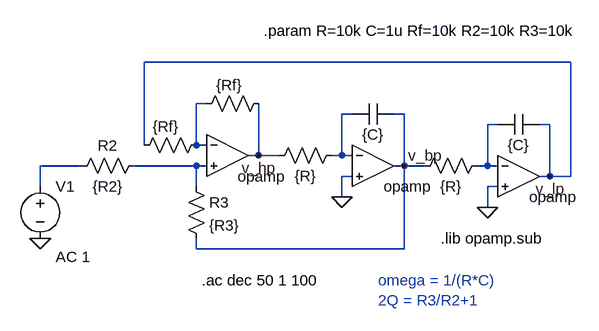
[diagram p0: schematic KHN_biquad.asc]
KHN_biquad.asc, the LTspice schematic file:
Version 4
SHEET 1 880 680
WIRE 496 0 -160 0
WIRE -64 64 -80 64
WIRE 160 80 144 80
WIRE 240 80 224 80
WIRE 384 96 368 96
WIRE 464 96 448 96
WIRE -160 128 -160 0
WIRE -80 128 -80 64
WIRE -64 128 -80 128
WIRE 16 144 16 64
WIRE 16 144 0 144
WIRE 48 144 16 144
WIRE 144 144 144 80
WIRE 144 144 128 144
WIRE 160 144 144 144
WIRE -256 160 -320 160
WIRE -80 160 -176 160
WIRE -64 160 -80 160
WIRE 240 160 240 80
WIRE 240 160 224 160
WIRE 272 160 240 160
WIRE 368 160 368 96
WIRE 368 160 352 160
WIRE 384 160 368 160
WIRE 160 176 144 176
WIRE 464 176 464 96
WIRE 464 176 448 176
WIRE 496 176 496 0
WIRE 496 176 464 176
WIRE -320 192 -320 160
WIRE -80 192 -80 160
WIRE 384 192 368 192
WIRE 144 208 144 176
WIRE 368 224 368 192
WIRE -80 288 -80 272
WIRE 240 288 240 160
WIRE 240 288 -80 288
FLAG 144 208 0
FLAG 368 224 0
FLAG -320 272 0
FLAG 16 144 v_hp
FLAG 240 160 v_bp
FLAG 464 176 v_lp
SYMBOL OpAmps\\opamp 192 96 R0
WINDOW 0 0 32 Invisible 2
SYMATTR InstName U1
SYMBOL res 144 128 R90
WINDOW 0 0 56 Invisible 2
WINDOW 3 32 56 VTop 2
SYMATTR InstName Ra
SYMATTR Value {R}
SYMBOL cap 224 64 R90
WINDOW 0 0 32 Invisible 2
WINDOW 3 32 32 VTop 2
SYMATTR InstName Ca
SYMATTR Value {C}
SYMBOL OpAmps\\opamp 416 112 R0
WINDOW 0 0 32 Invisible 2
SYMATTR InstName U2
SYMBOL res 368 144 R90
WINDOW 0 0 56 Invisible 2
WINDOW 3 32 56 VTop 2
SYMATTR InstName Rb
SYMATTR Value {R}
SYMBOL cap 448 80 R90
WINDOW 0 0 32 Invisible 2
WINDOW 3 32 32 VTop 2
SYMATTR InstName Cb
SYMATTR Value {C}
SYMBOL OpAmps\\opamp -32 80 R0
WINDOW 0 0 32 Invisible 2
SYMATTR InstName U3
SYMBOL res 32 48 R90
WINDOW 0 0 56 Invisible 2
WINDOW 3 -28 61 VTop 2
SYMATTR InstName Rf
SYMATTR Value {Rf}
SYMBOL res -64 112 R90
WINDOW 0 0 56 Invisible 2
WINDOW 3 -28 63 VTop 2
SYMATTR InstName R1
SYMATTR Value {Rf}
SYMBOL res -160 144 R90
WINDOW 0 0 56 VBottom 2
WINDOW 3 32 56 VTop 2
SYMATTR InstName R2
SYMATTR Value {R2}
SYMATTR SpiceLine tol=1 pwr=0.1
SYMBOL voltage -320 176 R0
WINDOW 123 24 124 Left 2
WINDOW 39 0 0 Left 0
SYMATTR Value2 AC 1
SYMATTR InstName V1
SYMATTR Value ""
SYMBOL res -96 176 R0
SYMATTR InstName R3
SYMATTR Value {R3}
TEXT -72 336 Left 2 !.ac dec 50 1 100
TEXT 296 272 Left 2 !.lib opamp.sub
TEXT 24 -48 Left 2 !.param R=10k C=1u Rf=10k R2=10k R3=10k
TEXT 200 336 Left 2 ;omega = 1/(R*C)\n2Q = R3/R2+1

The netlist it stands for:
* KHN_biquad.asc
XU1 N002 0 v_bp opamp Aol=100K GBW=10Meg  ; pins invin noninvin out
Ra N002 v_hp {R}
Ca v_bp N002 {C}
XU2 N003 0 v_lp opamp Aol=100K GBW=10Meg  ; pins invin noninvin out
Rb N003 v_bp {R}
Cb v_lp N003 {C}
XU3 N001 N005 v_hp opamp Aol=100K GBW=10Meg  ; pins invin noninvin out
Rf v_hp N001 {Rf}
R1 N001 v_lp {Rf}
R2 N005 N004 {R2} tol=1 pwr=0.1
V1 N004 0 AC 1
R3 N005 v_bp {R3}
.ac dec 50 1 100
.lib opamp.sub
.param R=10k C=1u Rf=10k R2=10k R3=10k
* omega = 1/(R*C)
* 2Q = R3/R2+1
.backanno
.end